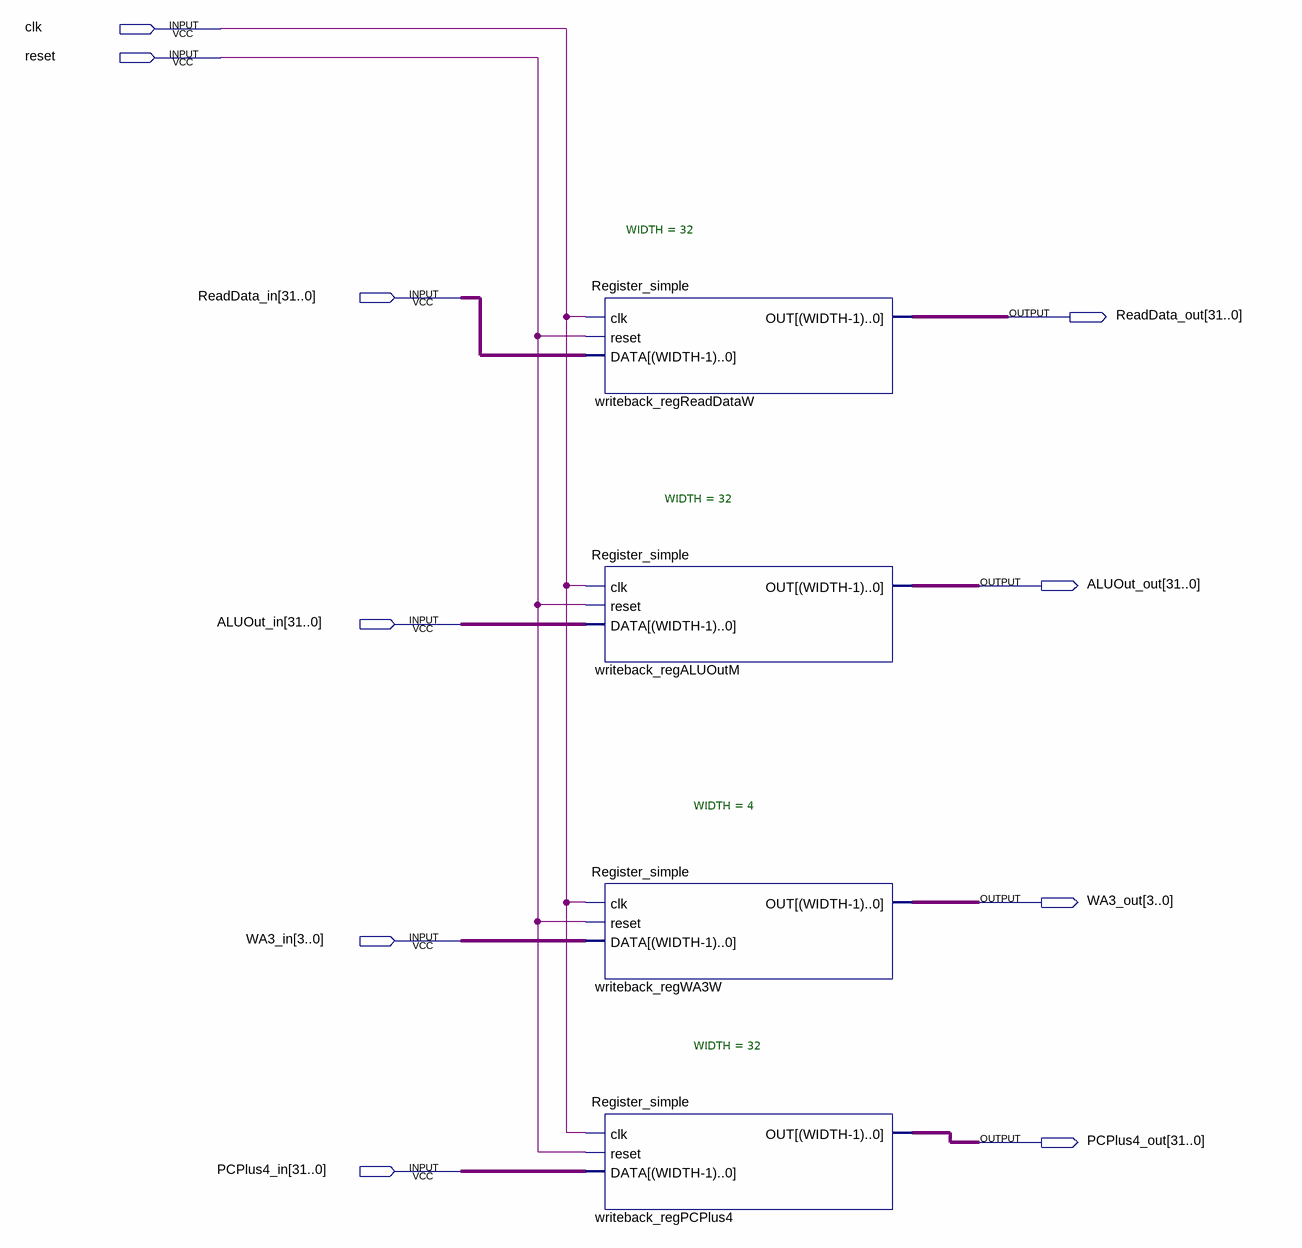
[diagram p0: schematic sheet]
// Quartus schematic writeback_register.bdf as structural Verilog: 4 symbols, 10 pins
module writeback_register (
  input  clk,
  input  reset,
  input  [31:0] ReadData_in,
  input  [31:0] ALUOut_in,
  input  [3:0] WA3_in,
  input  [31:0] PCPlus4_in,
  output [31:0] ReadData_out,
  output [31:0] ALUOut_out,
  output [3:0] WA3_out,
  output [31:0] PCPlus4_out
);

  Register_simple #(.WIDTH(32)) writeback_regReadDataW (
    .clk(clk), .reset(reset), .DATA(ReadData_in), .OUT(ReadData_out));
  Register_simple #(.WIDTH(32)) writeback_regALUOutM (.clk(clk), .reset(reset), .DATA(ALUOut_in), .OUT(ALUOut_out));
  Register_simple #(.WIDTH(4)) writeback_regWA3W (.clk(clk), .reset(reset), .DATA(WA3_in), .OUT(WA3_out));
  Register_simple #(.WIDTH(32)) writeback_regPCPlus4 (.clk(clk), .reset(reset), .DATA(PCPlus4_in), .OUT(PCPlus4_out));
endmodule
